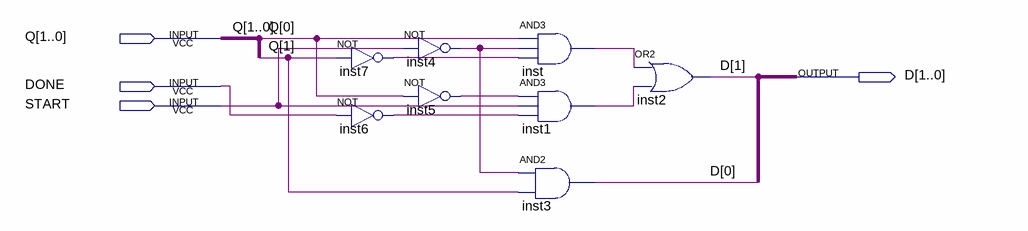
[diagram p0: schematic sheet]
// Quartus schematic Comb.bdf as structural Verilog: 8 symbols, 4 pins
module Comb (
  input  [1:0] Q,
  input  DONE,
  input  START,
  output [1:0] D
);

  wire inst1_out, inst4_out, inst5_out, inst6_out, inst7_out, inst_out;

  not inst7 (inst7_out, Q[1]);
  not inst6 (inst6_out, DONE);
  not inst4 (inst4_out, START);
  not inst5 (inst5_out, Q[0]);
  and inst (inst_out, Q[0], inst4_out, inst7_out);
  and inst1 (inst1_out, inst5_out, START, inst6_out);
  and inst3 (D[0], inst4_out, Q[1]);
  or inst2 (D[1], inst_out, inst1_out);
endmodule
